# Altium project TransmitterBoard.PrjPcb
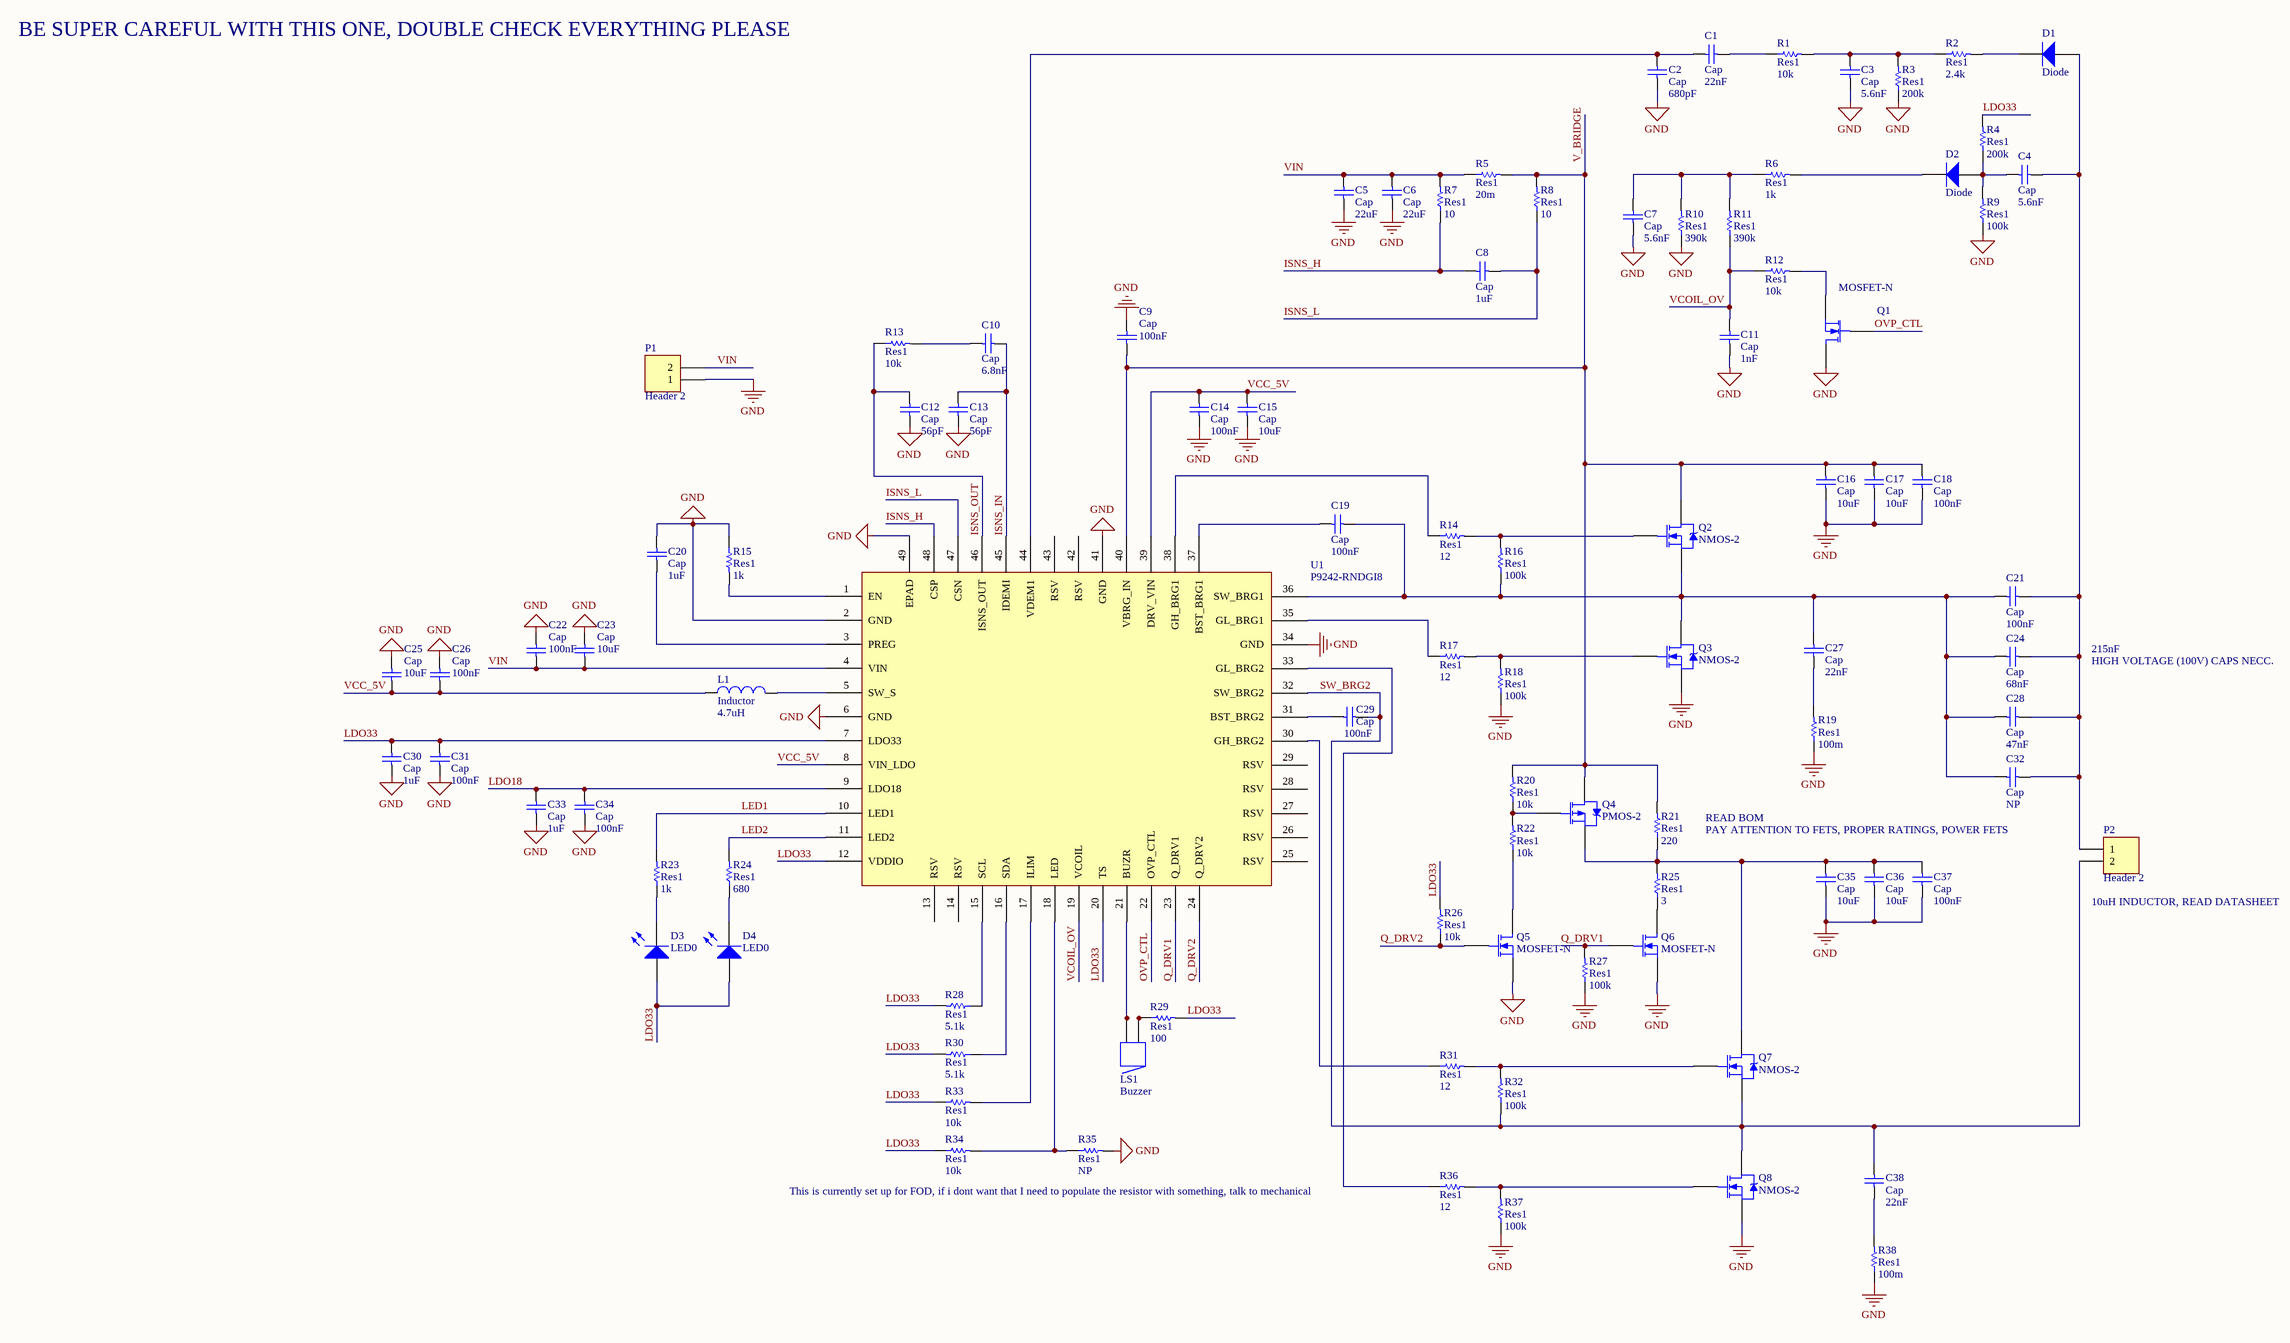
[diagram p0: TransmitterBoard.SchDoc]
1 sheet, 93 parts. Net scope: global (net labels, ports and power ports of the same name join across sheets).
Board file: TransmitterBoard.PcbDoc

## Sheet TransmitterBoard.SchDoc
size C

### Parts
C1  Cap  value 22nF  [1608[0603]]
C2  Cap  value 680pF  [1608[0603]]
C3  Cap  value 5.6nF  [1608[0603]]
C4  Cap  value 5.6nF  [1608[0603]]
C5  Cap  value 22uF  [C1210]
C6  Cap  value 22uF  [C1210]
C7  Cap  value 5.6nF  [1608[0603]]
C8  Cap  value 1uF  [1608[0603]]
C9  Cap  value 100nF  [1608[0603]]
C10  Cap  value 6.8nF  [1608[0603]]
C11  Cap  value 1nF  [1608[0603]]
C12  Cap  value 56pF  [1608[0603]]
C13  Cap  value 56pF  [1608[0603]]
C14  Cap  value 100nF  [1608[0603]]
C15  Cap  value 10uF  [6-0805_M]
C16  Cap  value 10uF  [6-0805_M]
C17  Cap  value 10uF  [6-0805_M]
C18  Cap  value 100nF  [1608[0603]]
C19  Cap  value 100nF  [1608[0603]]
C20  Cap  value 1uF  [1608[0603]]
C21  Cap  value 100nF  [6-0805_M]
C22  Cap  value 100nF  [1608[0603]]
C23  Cap  value 10uF  [6-0805_M]
C24  Cap  value 68nF  [6-0805_M]
C25  Cap  value 10uF  [6-0805_M]
C26  Cap  value 100nF  [1608[0603]]
C27  Cap  value 22nF  [1608[0603]]
C28  Cap  value 47nF  [6-0805_M]
C29  Cap  value 100nF  [1608[0603]]
C30  Cap  value 1uF  [1608[0603]]
C31  Cap  value 100nF  [1608[0603]]
C32  Cap  value NP  [6-0805_M]
C33  Cap  value 1uF  [1608[0603]]
C34  Cap  value 100nF  [1608[0603]]
C35  Cap  value 10uF  [6-0805_M]
C36  Cap  value 10uF  [6-0805_M]
C37  Cap  value 100nF  [1608[0603]]
C38  Cap  value 22nF  [1608[0603]]
D1  Diode  [X3-WLB1608-2]
D2  Diode  [X3-WLB1608-2]
D3  LED0  [1608[0603]]
D4  LED0  [1608[0603]]
L1  Inductor  value 4.7uH  [0402-A]
LS1  Buzzer  [ABSM-1574]
P1  Header 2  [2-1445096-2]
P2  Header 2  [2-1445096-2]
Q1  MOSFET-N  [SOT23_M]
Q2  NMOS-2  [DMG7430LFG-7]
Q3  NMOS-2  [DMG7430LFG-7]
Q4  PMOS-2  [TRANS_AONR21321]
Q5  MOSFET-N  [SOT23_M]
Q6  MOSFET-N  [SOT23_M]
Q7  NMOS-2  [DMG7430LFG-7]
Q8  NMOS-2  [DMG7430LFG-7]
R1  Res1  value 10k  [1608[0603]]
R2  Res1  value 2.4k  [6-0805_M]
R3  Res1  value 200k  [6-0805_M]
R4  Res1  value 200k  [6-0805_M]
R5  Res1  value 20m  [6-0805_M]
R6  Res1  value 1k  [1608[0603]]
R7  Res1  value 10  [6-0805_M]
R8  Res1  value 10  [6-0805_M]
R9  Res1  value 100k  [1608[0603]]
R10  Res1  value 390k  [1608[0603]]
R11  Res1  value 390k  [1608[0603]]
R12  Res1  value 10k  [1608[0603]]
R13  Res1  value 10k  [1608[0603]]
R14  Res1  value 12  [6-0805_M]
R15  Res1  value 1k  [1608[0603]]
R16  Res1  value 100k  [1608[0603]]
R17  Res1  value 12  [6-0805_M]
R18  Res1  value 100k  [1608[0603]]
R19  Res1  value 100m  [6-0805_M]
R20  Res1  value 10k  [1608[0603]]
R21  Res1  value 220  [1608[0603]]
R22  Res1  value 10k  [1608[0603]]
R23  Res1  value 1k  [1608[0603]]
R24  Res1  value 680  [6-0805_M]
R25  Res1  value 3  [6-0805_M]
R26  Res1  value 10k  [1608[0603]]
R27  Res1  value 100k  [1608[0603]]
R28  Res1  value 5.1k  [6-0805_M]
R29  Res1  value 100  [6-0805_M]
R30  Res1  value 5.1k  [6-0805_M]
R31  Res1  value 12  [6-0805_M]
R32  Res1  value 100k  [1608[0603]]
R33  Res1  value 10k  [1608[0603]]
R34  Res1  value 10k  [1608[0603]]
R35  Res1  value NP  [1608[0603]]
R36  Res1  value 12  [6-0805_M]
R37  Res1  value 100k  [1608[0603]]
R38  Res1  value 100m  [6-0805_M]
U1  P9242-RNDGI8  [QFN40P600X600X100-49N]

### Nets
GND: C2.1 C3.1 C5.1 C6.1 C7.1 C9.1 C11.1 C12.1 C13.1 C14.1 C15.1 C16.1 C17.1 C18.1 C20.1 C22.1 C23.1 C25.1 C26.1 C30.1 C31.1 C33.1 C34.1 C35.1 C36.1 C37.1 P1.1 Q1.1(D) Q3.3(S) Q5.3(S) Q6.3(S) Q8.3(S) R3.1 R9.1 R10.1 R15.1 R18.1 R19.1 R27.1 R35.2 R37.1 R38.1 U1.2(GND) U1.6(GND) U1.34(GND) U1.41(GND) U1.49(EPAD)
ISNS_H: C8.1 R7.1 U1.48(CSP)
ISNS_IN: C10.2 C13.2 U1.45(IDEMI)
ISNS_L: C8.2 R8.1 U1.47(CSN)
ISNS_OUT: C12.2 R13.1 U1.46(ISNS_OUT)
LDO18: C33.2 C34.2 U1.9(LDO18)
LDO33: C30.2 C31.2 D3.1(A) D4.1(A) R4.2 R26.2 R28.2 R29.2 R30.2 R33.1 R34.1 U1.7(LDO33) U1.12(VDDIO) U1.20(TS)
LED1: R23.2 U1.10(LED1)
LED2: R24.2 U1.11(LED2)
OVP_CTL: Q1.2(G) U1.22(OVP_CTL)
Q_DRV1: Q6.2(G) R27.2 U1.23(Q_DRV1)
Q_DRV2: Q5.2(G) R26.1 U1.24(Q_DRV2)
SW_BRG2: C29.2 C38.2 P2.2 Q7.3(S) Q8.2(D) R32.1 U1.32(SW_BRG2)
V_BRIDGE: C9.2 C16.2 C17.2 C18.2 Q2.2(D) Q4.2(D) R5.2 R8.2 R20.2 R21.2 U1.40(VBRG_IN)
VCC_5V: C14.2 C15.2 C25.2 C26.2 L1.1 U1.8(VIN_LDO) U1.39(DRV_VIN)
VCOIL_OV: C11.2 R11.1 R12.1 U1.19(VCOIL)
VIN: C5.2 C6.2 C22.2 C23.2 P1.2 R5.1 R7.2 U1.4(VIN)
NetC1_1: C1.1 C2.2 U1.44(VDEM1)
NetC1_2: C1.2 R1.1
NetC3_2: C3.2 R1.2 R2.1 R3.2
NetC4_1: C4.1 D2.1(A) R4.1 R9.2
NetC4_2: C4.2 C21.2 C24.2 C28.2 C32.2 D1.1(A) P2.1
NetC7_2: C7.2 R6.1 R10.2 R11.2
NetC10_1: C10.1 R13.2
NetC19_1: C19.1 U1.37(BST_BRG1)
NetC19_2: C19.2 C21.1 C24.1 C27.2 C28.1 C32.1 Q2.3(S) Q3.2(D) R16.1 U1.36(SW_BRG1)
NetC20_2: C20.2 U1.3(PREG)
NetC27_1: C27.1 R19.2
NetC29_1: C29.1 U1.31(BST_BRG2)
NetC35_2: C35.2 C36.2 C37.2 Q4.3(S) Q7.2(D) R21.1 R25.2
NetC38_1: C38.1 R38.2
NetD1_2: D1.2(K) R2.2
NetD2_2: D2.2(K) R6.2
NetD3_2: D3.2(K) R23.1
NetD4_2: D4.2(K) R24.1
NetL1_2: L1.2 U1.5(SW_S)
NetLS1_1: LS1.1 LS1.1A R29.1
NetLS1_2: LS1.2 LS1.2A U1.21(BUZR)
NetQ1_3: Q1.3(S) R12.2
NetQ2_1: Q2.1(G) R14.2 R16.2
NetQ3_1: Q3.1(G) R17.2 R18.2
NetQ4_1: Q4.1(G) R20.1 R22.2
NetQ5_1: Q5.1(D) R22.1
NetQ6_1: Q6.1(D) R25.1
NetQ7_1: Q7.1(G) R31.2 R32.2
NetQ8_1: Q8.1(G) R36.2 R37.2
NetR14_1: R14.1 U1.38(GH_BRG1)
NetR15_2: R15.2 U1.1(EN)
NetR17_1: R17.1 U1.35(GL_BRG1)
NetR28_1: R28.1 U1.15(SCL)
NetR30_1: R30.1 U1.16(SDA)
NetR31_1: R31.1 U1.30(GH_BRG2)
NetR33_2: R33.2 U1.17(ILIM)
NetR34_2: R34.2 R35.1 U1.18(LED)
NetR36_1: R36.1 U1.33(GL_BRG2)

Not connected (* = marked no-connect by the designer): U1 13(RSV) 14(RSV) 25(RSV) 26(RSV) 27(RSV) 28(RSV) 29(RSV) 42(RSV) 43(RSV)

### Notes on the sheet
- BE SUPER CAREFUL WITH THIS ONE, DOUBLE CHECK EVERYTHING PLEASE
- HIGH VOLTAGE (100V) CAPS NECC.
- 215nF
- PAY ATTENTION TO FETS, PROPER RATINGS, POWER FETS
- READ BOM
- (near P2) 10uH INDUCTOR, READ DATASHEET
- (near R36) This is currently set up for FOD, if i dont want that I need to populate the resistor with something, talk to mechanical

### Library data of the parts
C1-C38 = Cap: Capacitor; Published: 8-Jun-2000; LatestRevisionDate: 17-Jul-2002; LatestRevisionNote: Re-released for DXP Platform.; PackageReference: RAD-0.3; Publisher: Altium Limited; PackageDescription: Radial Cap, Thru-Hole; 2 Leads; 0.3 in Pin Spacing
D1 D2 = Diode: Default Diode; Published: 8-Jun-2000; LatestRevisionDate: 17-Jul-2002; LatestRevisionNote: Re-released for DXP Platform.; PackageVersion: Sep-1996; PackageReference: SMC; Publisher: Altium Limited; PackageDescription: DO-214-AB/SMC; 2 C-Bend Leads; Body 7.9 x 5.9 mm, inc. leads (LxW); Code_JEDEC: DO-214-AB
L1 = Inductor: Code_IEC: 1005; Published: 8-Jun-2000; LatestRevisionDate: 29-May-2009; LatestRevisionNote: IPC-7351 Footprint Added.; PackageReference: 0402-A; Publisher: Altium Limited; PackageDescription: Chip Inductor; Code_JEITA: 0402
LS1 = Buzzer: Magnetic Transducer Buzzer; Published: 24-Mar-1999; LatestRevisionDate: 17-Dec-2003; LatestRevisionNote: Schematic revised, PCB Footprint replaced.; DatasheetVersion: 17-Dec-2003; PackageReference: ABSM-1574; Publisher: Altium Limited; PackageDescription: Magnetic Transducer Buzzer; ComponentLink1Description: Manufacturer Link; ComponentLink1URL: http://www.megastar.com/linecard/buzzmode/index.php
P1 P2 = Header 2: Header, 2-Pin; LatestRevisionDate: 17-Jul-2002; LatestRevisionNote: Re-released for DXP Platform.; Publisher: Altium Limited
Q1 Q5 Q6 = MOSFET-N: N-Channel MOSFET; Published: 8-Jun-2000; LatestRevisionDate: 17-Jul-2002; LatestRevisionNote: Re-released for DXP Platform.; PackageVersion: 1995/1996; PackageReference: E3; Publisher: Altium Limited; PackageDescription: TO, Flat Index; 3 In-Line, Axial Leads; Body Dia. 4.6mm; Lead Dia. 0.5 mm (max)
Q2 Q3 Q7 Q8 = NMOS-2: N-Channel Power MOSFET; Note: Pin 2 is electrically connected to pin 4.; Published: 8-Jun-2000; LatestRevisionDate: 17-Jul-2002; LatestRevisionNote: Re-released for DXP Platform.; DatasheetVersion: PD-9.814; PackageVersion: Feb-1997; PackageReference: TO-220AB; Publisher: Altium Limited; PackageDescription: TO, Thru-Hole, Vertical, Heatsink Mounted; 3 In-Line Leads; Pitch 2.54 mm; ComponentLink1Description: Manufacturer Link; ComponentLink1URL: http://www.irf.com/
Q4 = PMOS-2: P-Channel Power MOSFET; Note: Pin 4 not drawn and electrically connected to Pin 2.; Published: 8-Jun-2000; LatestRevisionDate: 17-Jul-2002; LatestRevisionNote: Re-released for DXP Platform.; DatasheetVersion: PD-9.390D; PackageVersion: Feb-1997; PackageReference: TO-220AB; Publisher: Altium Limited; PackageDescription: TO, Thru-Hole, Vertical, Heatsink Mounted; 3 In-Line Leads; Pitch 2.54 mm; ComponentLink1Description: Manufacturer Link; ComponentLink1URL: http://www.irf.com/
R1-R38 = Res1: Resistor; Published: 8-Jun-2000; LatestRevisionDate: 17-Jul-2002; LatestRevisionNote: Re-released for DXP Platform.; PackageReference: AXIAL-0.3; Publisher: Altium Limited; PackageDescription: Axial Device, Thru-Hole; 2 Leads; 0.3 in Pin Spacing
U1 = Component_1
D3 D4 = LED0: Published: 8-Jun-2000; LatestRevisionDate: 08-Jul-2005; LatestRevisionNote: Mech Layer 1 removed.; PackageReference: LED-0; Publisher: Altium Limited; PackageDescription: LED; 2 Leads